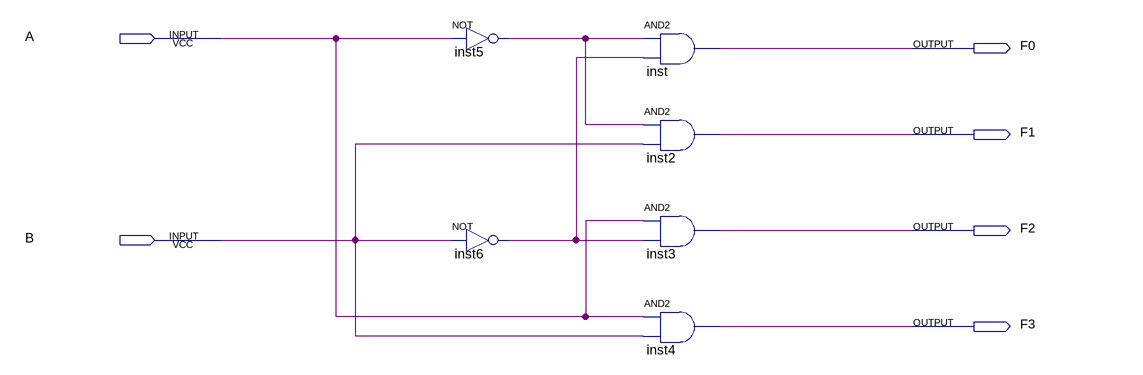
[diagram p0: schematic sheet]
// Quartus schematic decoder1021.bdf as structural Verilog: 6 symbols, 6 pins
module decoder1021 (
  input  A,
  input  B,
  output F0,
  output F1,
  output F2,
  output F3
);

  wire inst5_out, inst6_out;

  not inst5 (inst5_out, A);
  not inst6 (inst6_out, B);
  and inst (F0, inst5_out, inst6_out);
  and inst2 (F1, inst5_out, B);
  and inst3 (F2, A, inst6_out);
  and inst4 (F3, A, B);
endmodule
